# EasyEDA schematic MySpot Limit Switch.json
TITLE: Limit switch; REV: 1.0; Date: 2023-10-07; Sheet: 1/1; Drawn By: Kincses Bendeguz; Company: Kincses
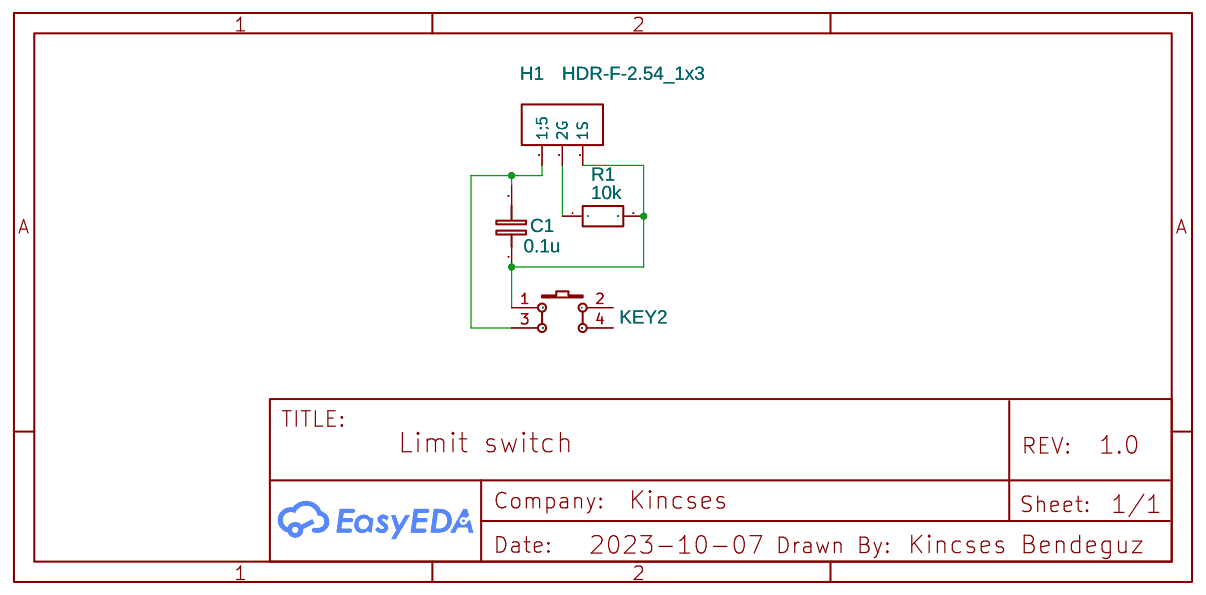
[diagram p0: schematic sheet]

## Parts
C1  0.1u  [RAD-0.1]
H1  HDR-F-2.54_1x3  [HDR-F-2.54_1X3]
KEY2  K4-12×12_TH  [KEY-TH_4P-L12.0-W12.0-P5.00-LS12.5]
R1  10k  [R0805]

## Library data of the parts
C1 = C_RAD-0.1_EU: Contributor: LCEDA_Lib
H1 = HDR-F-2.54_1x3: Supplier Part: C146690; Supplier: LCSC; Contributor: LCEDA_Lib
KEY2 = K4-12×12_TH: Supplier Part: C128053; Supplier: LCSC; Manufacturer: 韩国韩荣; Manufacturer Part: K2-1103DP-M4SW-04; Contributor: LCEDA_Lib
R1 = R_0805_EU: Contributor: LCEDA_Lib

## Nets
Net-(C1-1): C1.1 H1.3(1S) KEY2.1(2) R1.2
Net-(C1-2): C1.2 H1.1(1;5) KEY2.3(1)
Net-(H1-2): H1.2(2G) R1.1

Not connected (* = marked no-connect by the designer): KEY2 2(4) 4(3)
